# Altium schematic sheet sESP.SchDoc
size A3; Revision: 7
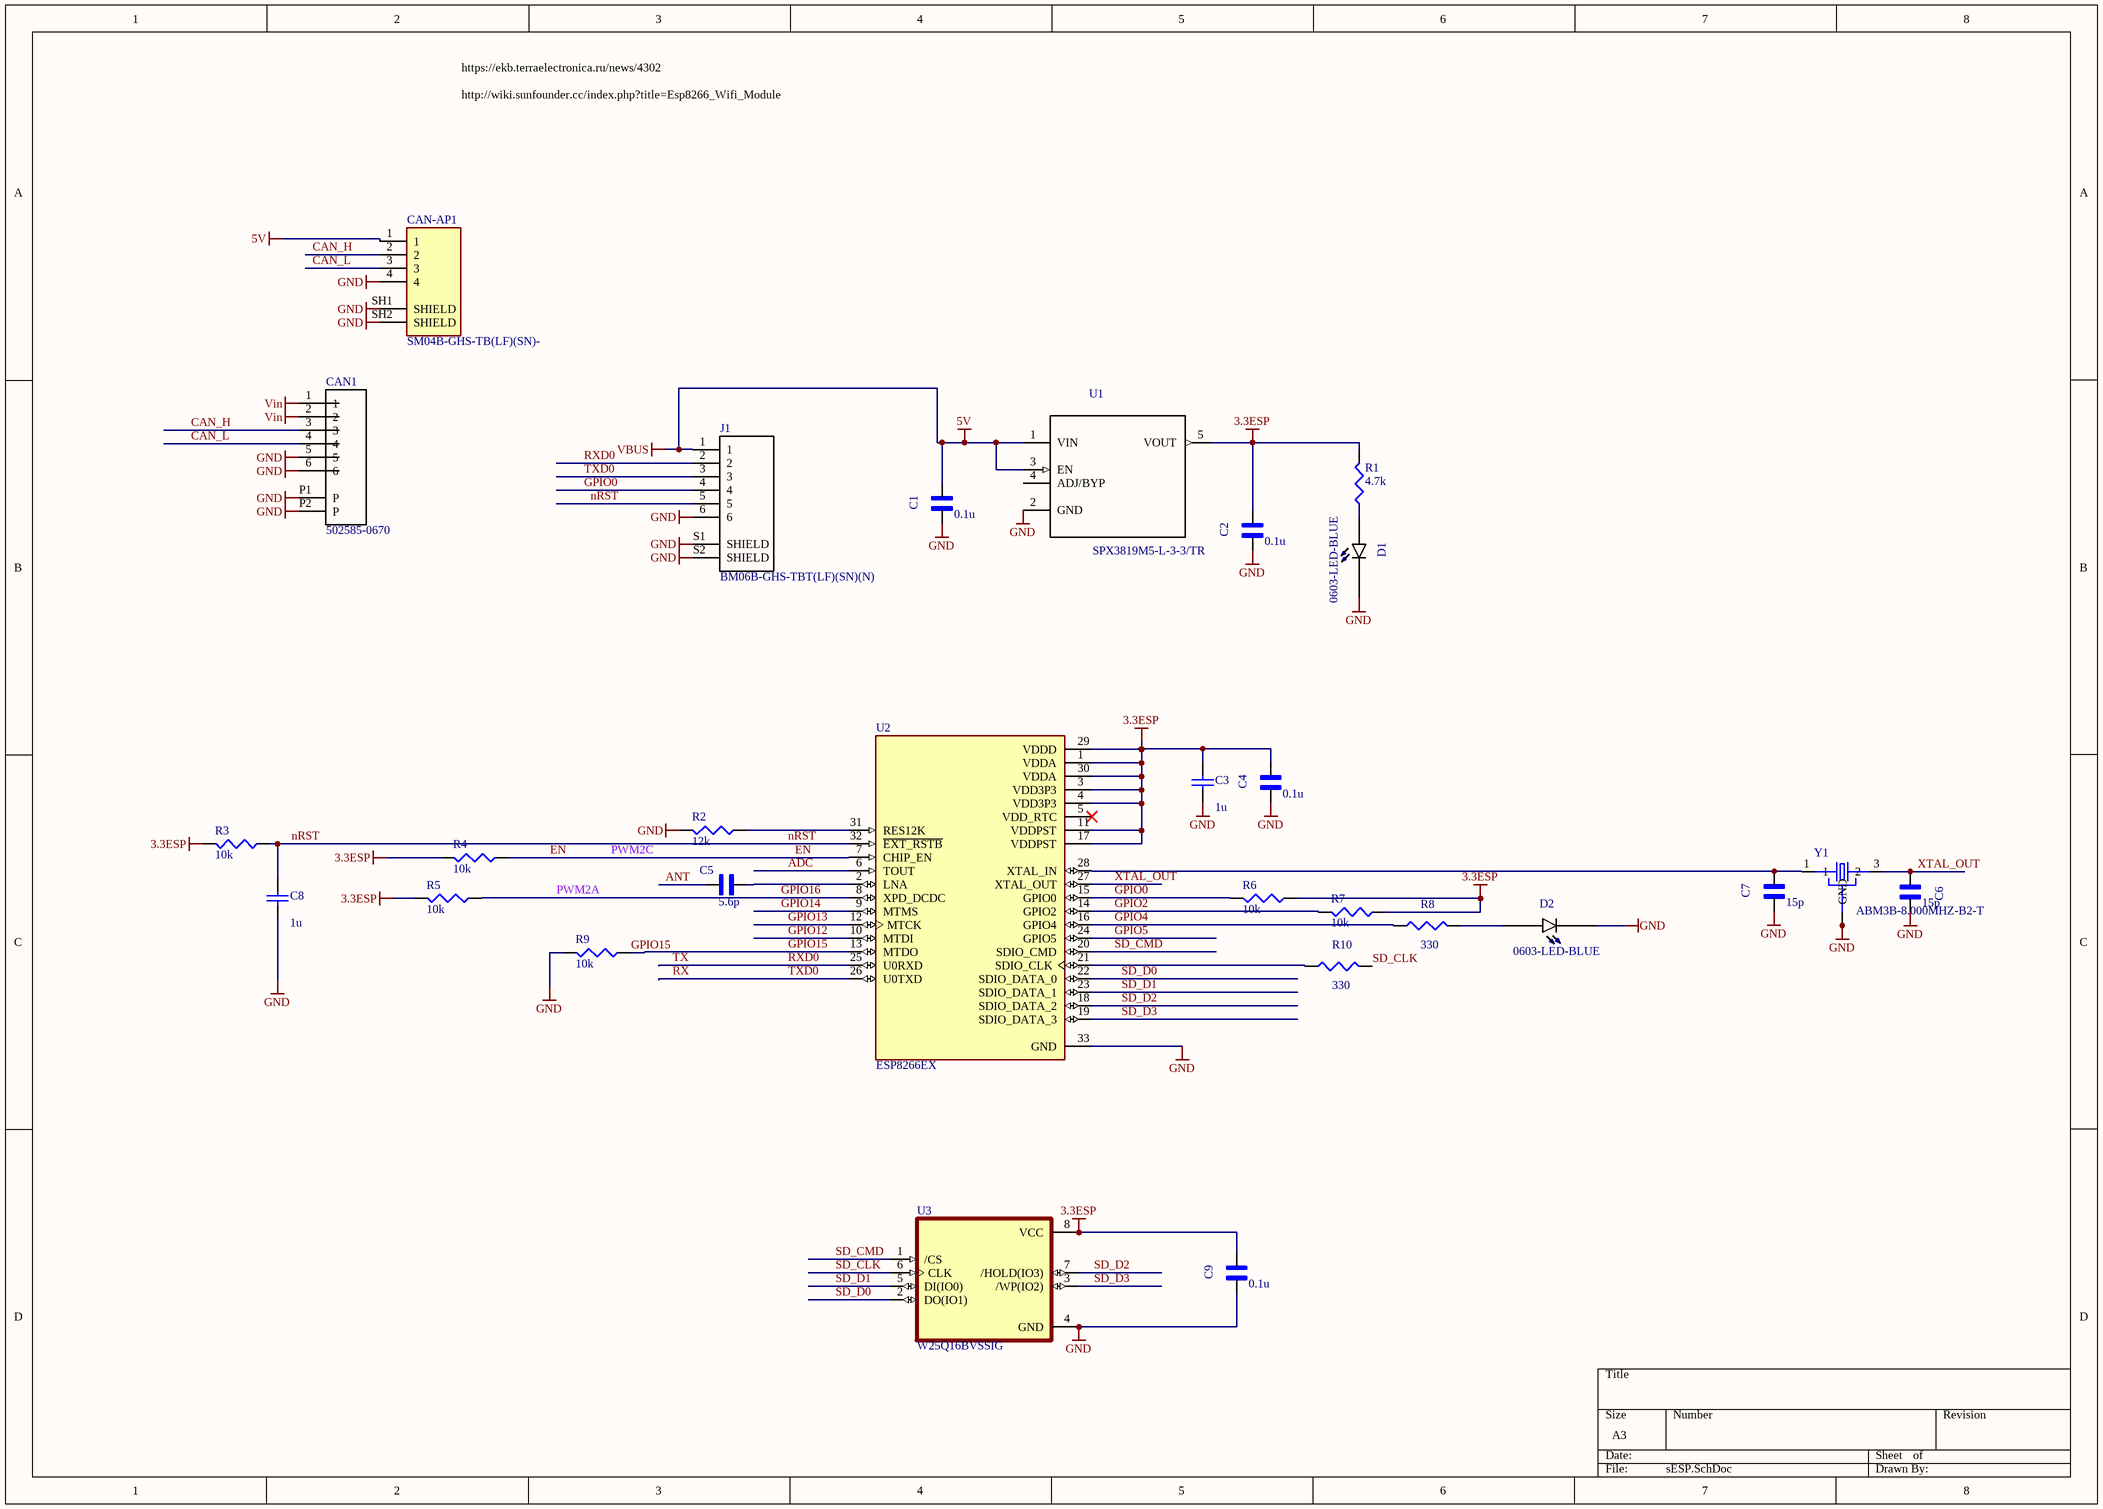
[diagram p0: sESP.SchDoc]

## Parts
C1  value 0.1u  [*CAPC1608X90]  (hidden comment: GX035C104MAT2-500)
C2  value 0.1u  [*CAPC1608X90]  (hidden comment: GX035C104MAT2-500)
C3  value 1u  [1608[0603]]  (hidden comment: Cap Semi)
C4  value 0.1u  [*CAPC1608X90]  (hidden comment: GX035C104MAT2-500)
C5  value 5.6p  [*CAPC1608X90]  (hidden comment: GX035C104MAT2-500)
C6  value 15p  [*CAPC1608X90N]  (hidden comment: GRM1885C2A150JA01J)
C7  value 15p  [*CAPC1608X90N]  (hidden comment: GRM1885C2A150JA01J)
C8  value 1u  [1608[0603]]  (hidden comment: Cap Semi)
C9  value 0.1u  [*CAPC1608X90]  (hidden comment: GX035C104MAT2-500)
CAN1  502585-0670  [MOLEX_502585-0670]
CAN-AP1  SM04B-GHS-TB(LF)(SN)-  [JST_SM04B-GHS-TB(LF)(SN)-]
D1  0603-LED-BLUE  [*LEDM1608X80_LTE-C1906R-14(Primary)]
D2  0603-LED-BLUE  [*LEDM1608X80_LTE-C1906R-14(Primary)]
J1  BM06B-GHS-TBT(LF)(SN)(N)  [*JST_BM06B-GHS-TBT(LF)(SN)(N)_BM06B-GHS-TBT(LF)(SN)(N)(Primary)]
R1  value 4.7k  [J1-0603]  (hidden comment: Res3)
R2  value 12k  [J1-0603]  (hidden comment: RC0603FR-0710KL)
R3  value 10k  [J1-0603]  (hidden comment: Res3)
R4  value 10k  [J1-0603]  (hidden comment: Res3)
R5  value 10k  [J1-0603]  (hidden comment: Res3)
R6  value 10k  [J1-0603]  (hidden comment: Res3)
R7  value 10k  [J1-0603]  (hidden comment: Res3)
R8  value 330  [J1-0603]  (hidden comment: Res3)
R9  value 10k  [J1-0603]  (hidden comment: Res3)
R10  value 330  [J1-0603]  (hidden comment: Res3)
U1  SPX3819M5-L-3-3/TR  [*SOT95P280X145-5N]
U2  ESP8266EX  [QFN50P500X500X80-33N]
U3  W25Q16BVSSIG  [SOIC127P790X216-8N]
Y1  ABM3B-8.000MHZ-B2-T  [OSCSC500X320X110-4N]

## Nets
3.3ESP: C2.1 C3.1 C4.1 C9.1 R1.2 R3.2 R4.2 R5.2 R6.1 R7.1 U1.5(VOUT) U2.1(VDDA) U2.3(VDD3P3) U2.4(VDD3P3) U2.11(VDDPST) U2.17(VDDPST) U2.29(VDDD) U2.30(VDDA) U3.8(VCC)
5V: C1.1 CAN-AP1.1 J1.1 U1.1(VIN) U1.3(EN)  [also labelled VBUS]
GND: C1.2 C2.2 C3.2 C4.2 C6.2 C7.1 C8.2 C9.2 CAN1.5 CAN1.6 CAN1.P1(P) CAN1.P2(P) CAN-AP1.4 CAN-AP1.SH1(SHIELD) CAN-AP1.SH2(SHIELD) D1.C D2.C J1.6 J1.S1(SHIELD) J1.S2(SHIELD) R2.2 R9.2 U1.2(GND) U2.33(GND) U3.4(GND) Y1.2(GND) Y1.4(GND)
Vin: CAN1.1 CAN1.2
ADC: U2.6(TOUT)
ANT: C5.1
CAN_H: CAN1.3 CAN-AP1.2
CAN_L: CAN1.4 CAN-AP1.3
EN: R4.1 U2.7(CHIP_EN)  [also labelled PWM2C]
GPIO0: J1.4 R6.2 U2.15(GPIO0)
GPIO2: R7.2 U2.14(GPIO2)
GPIO4: R8.1 U2.16(GPIO4)
GPIO5: U2.24(GPIO5)
GPIO12: U2.10(MTDI)
GPIO13: U2.12(MTCK)
GPIO14: U2.9(MTMS)
GPIO15: R9.1 U2.13(MTDO)
GPIO16: R5.1 U2.8(XPD_DCDC)  [also labelled PWM2A]
nRST: C8.1 J1.5 R3.1 U2.32(~{EXT_RSTB})
RX: J1.3 U2.26(U0TXD)  [also labelled TXD0]
RXD0: J1.2 U2.25(U0RXD)  [also labelled TX]
SD_CLK: R10.2 U3.6(CLK)
SD_CMD: U2.20(SDIO_CMD) U3.1(/CS)
SD_D0: U2.22(SDIO_DATA_0) U3.2(DO(IO1))
SD_D1: U2.23(SDIO_DATA_1) U3.5(DI(IO0))
SD_D2: U2.18(SDIO_DATA_2) U3.7(/HOLD(IO3))
SD_D3: U2.19(SDIO_DATA_3) U3.3(/WP(IO2))
XTAL_OUT: C6.1 U2.27(XTAL_OUT) Y1.3(2)
NetC5_2: C5.2 U2.2(LNA)
NetC7_2: C7.2 U2.28(XTAL_IN) Y1.1
NetD1_A: D1.A R1.1
NetD2_A: D2.A R8.2
NetR2_1: R2.1 U2.31(RES12K)
NetR10_1: R10.1 U2.21(SDIO_CLK)

Not connected (* = marked no-connect by the designer): U1 4(ADJ/BYP); U2 5(VDD_RTC)*

## Notes on the sheet
- https://ekb.terraelectronica.ru/news/4302
- http://wiki.sunfounder.cc/index.php?title=Esp8266_Wifi_Module

## Library data of the parts
C1 C2 = GX035C104MAT2-500: Cap Thin Film 0.1uf 50v 0603; MF: AVX; Pacage Metric: 1608; Type: SMD; Package: 0603 AVX; MP: GX035C104MAT2-500; SnapEDA_Link: https://www.snapeda.com/parts/GX035C104MAT2-500/AVX/view-part/?ref=snap
C3 C8 = Cap Semi: Capacitor (Semiconductor SIM Model); Published: 8-Jun-2000; LatestRevisionDate: 29-May-2009; LatestRevisionNote: IPC-7351 Footprint Added.; PackageReference: C1206; Publisher: Altium Limited; PackageDescription: Chip Capacitor
C4 C5 C9 = GX035C104MAT2-500: Cap Thin Film 0.1uf 50v 0603; MF: AVX; MP: GX035C104MAT2-500 or CL10B104JB8NNNC; Pacage Metric: 1608; Type: SMD; Package: 0603 AVX; SnapEDA_Link: https://www.snapeda.com/parts/GX035C104MAT2-500/AVX/view-part/?ref=snap
CAN1 = 502585-0670: 1.50mm Pitch, CLIK-Mate PCB Receptacle, Single Row, Surface Mount, Right-Angle, Tin Plating, Positive Lock, 6 Circuits, Natural; MF: Molex; System: Connector; MP: 502585-0670; Package: None; SnapEDA_Link: https://www.snapeda.com/parts/502494-0670/Molex/view-part/?ref=snap; Value: *; Type: SMD
CAN-AP1 = SM04B-GHS-TB(LF)(SN)-: Connector Header Surface Mount, Right Angle 4 position 0.049 _1.25mm_; MF: JST Sales; MP: SM04B-GHS-TB(LF)(SN); Package: None; Value: *; SnapEDA_Link: https://www.snapeda.com/parts/SM04B-GHS-TB%28LF%29%28SN%29-/JST%20Sales%20America%20Inc./view-part/2759740/?ref=snap; HelpURL: http://www.farnell.com/datasheets/2082975.pdf; System: Connector; ChipDip_Link: https://www.chipdip.ru/product/sm04b-ghs-tb-lf-sn-gh-1.25mm-header-side-ent
D1 D2 = LTE-C1906R-14: LED IrLED Chip LED 2-Pin SMD T/R; Package: 0603 Lite-On; MP: 0603-LED-BLUE; SnapEDA_Link: https://www.snapeda.com/parts/LTE-C1906R-14/Lite-On%20Inc./view-part/?ref=snap; Value: *; Type: SMD
J1 = BM06B-GHS-TBT(LF)(SN)(N): Conn Header Gh Top 6pos 1.25mm; MP: BM06B-GHS-TBT_LF__SN__N_; MF: JST Sales; Package: None; Availability: Unavailable; SnapEDA_Link: https://www.snapeda.com/parts/BM06B-GHS-TBT%28LF%29%28SN%29%28N%29/JST%20Sales%20America%20Inc./view-part/?ref=snap; Price: None; Value: *
R1 = Res3: Resistor; Pacage Metric: 1608; MP: 4.7K 1% 0603; ChipDip_Link: https://www.chipdip.ru/product0/9000079736; HelpURL: https://www.chipdip.ru/product0/9000079736; Package: R0603; Type: SMD
R2 = RC0603FR-0710KL: 10 kOhms 1 0.1 W 1 10 W Chip Resistor 0603 1608 Metric Thick Film; Pacage Metric: 1608; MF: Yageo or NXP; MP: 10K 1% 0603; ChipDip_Link: https://www.chipdip.ru/product0/9000079736; HelpURL: https://www.chipdip.ru/product0/9000079736; Package: R0603; Type: SMD; SnapEDA_Link: https://www.snapeda.com/parts/RC0603FR-0710KL/Yageo/view-part/?ref=dk&t=RC0603FR-0710KL&con_ref=None
R3-R7 R9 = Res3: Resistor; Pacage Metric: 1608; MP: 10K 1% 0603; ChipDip_Link: https://www.chipdip.ru/product0/9000079736; HelpURL: https://www.chipdip.ru/product0/9000079736; Package: R0603; Type: SMD
R8 R10 = Res3: Resistor; Pacage Metric: 1608; MP: RC0603FR-07330RL; ChipDip_Link: https://www.chipdip.ru/product0/9000079628; HelpURL: https://www.chipdip.ru/product0/9000079628; Package: R0603; Type: SMD
U1 = SPX3819M5-L: Low Dropout Voltage Regulator, Adjustable 0.5A, В±1%, 2.5 to 16 Vin, 5-Pin SOT-23; MF: MaxLinear, Inc.; Value: 3V3; MP: SPX3819M5-L-3-3/TR; Package: SOT-23-5 Exar; SnapEDA_Link: https://www.snapeda.com/parts/SPX3819M5-L/MaxLinear%2C%20Inc./view-part/?ref=snap; Type: SMD; ChipDip_Link: https://www.chipdip.ru/product1/8003455237; HelpURL: http://www.farnell.com/datasheets/2614478.pdf
U2 = ESP8266EX: IC RF TxRx + MCU WiFi 802.11b/g/n 2.4GHz 32-VFQFN Exposed Pad; MF: Espressif Systems; SnapEDA_Link: https://www.snapeda.com/parts/ESP8266EX/Espressif%20Systems/view-part/555861/?ref=snap; Value: *; Purchase-URL: https://pricing.snapeda.com/search/part/ESP8266EX/?ref=eda; Price: None; Availability: Warning; MP: ESP8266EX; Package: VFQFN-32 Espressif Systems; Check_prices: https://www.snapeda.com/parts/ESP8266EX/Espressif%20Systems/view-part/555861/?ref=eda
U3 = W25Q16BVSSIG: Flash, pin, soic, flash, Memory, Semiconductors and Actives, serial, ic; MF: {'manufacturer': u'Winbond'}; MP: W25Q16BVSSIG; Availability: Unavailable; Value: *; Price: None; Package: None
Y1 = ABM3B-8.000MHZ-B2-T: Crystal 8MHz В±20ppm (Tol) В±50ppm (Stability) 18pF FUND 200Ohm 4-Pin CSMD T/R; MF: {'manufacturer': u'Abracon'}; Value: *; Price: None; Package: None; Availability: Unavailable; MP: ABM3B-8.000MHZ-B2-T
C6 C7 = GRM1885C2A150JA01J: SnapEDA_Link: https://www.snapeda.com/parts/GRM1885C2A150JA01J/Murata/view-part/1812122/?ref=snap; ChipDip_Link: https://www.chipdip.ru/product/grm1885c2a150j; HelpURL: https://static.chipdip.ru/lib/428/DOC005428493.pdf